# Altium schematic sheet alternative-amp.SchDoc
size A4
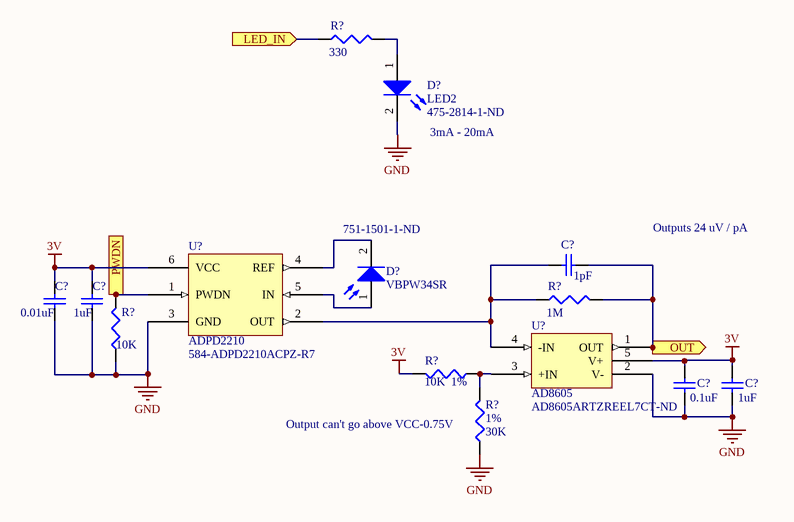
[diagram p0: alternative-amp.SchDoc]

## Parts
(Parts that share a designator on the sheet are numbered #1, #2 ... from top to bottom, then left to right.)
C?#1  value 1pF  [C1206]  (hidden comment: Cap Semi)
C?#2  value 0.01uF  [C1206]  (hidden comment: Cap Semi)
C?#3  value 1uF  [C1206]  (hidden comment: Cap Semi)
C?#4  value 0.1uF  [C1206]  (hidden comment: Cap Semi)
C?#5  value 1uF  [C1206]  (hidden comment: Cap Semi)
D?#1  LED2  Supplier Part Number: 475-2814-1-ND  [LB P4SG]
D?#2  VBPW34SR  Supplier Part Number: 751-1501-1-ND  [VBPW34SR]
R?#1  value 330  [J1-0603]  (hidden comment: Res3)
R?#2  value 1M  [J1-0603]  (hidden comment: Res3)
R?#3  value 10K  [J1-0603]  (hidden comment: Res3)
R?#4  1%  value 10K  [J1-0603]
R?#5  1%  value 30K  [J1-0603]
U?#1  ADPD2210  Supplier Part Number 1: 584-ADPD2210ACPZ-R7  [LFCSP_UD65P200X200-6N]
U?#2  AD8605  Supplier Part Number 1: AD8605ARTZREEL7CT-ND  [SOT23-6_N]

## Ports
LED_IN (in), OUT (out), PWDN

## Nets
3V: C?#2.2 C?#3.2 C?#4.2 C?#5.2 R?#4.2 U?#1.6(VCC) U?#2.5(V+)
GND: C?#2.1 C?#3.1 C?#4.1 C?#5.1 D?#1.2(K) R?#3.1 R?#5.1 U?#1.3(GND) U?#2.2(V-)
LED_IN: R?#1.1 ; port LED_IN
OUT: C?#1.2 R?#2.2 U?#2.1(OUT) ; port OUT
PWDN: R?#3.2 U?#1.1(PWDN) ; port PWDN
NetC?#1_1: C?#1.1 R?#2.1 U?#1.2(OUT) U?#2.4(-IN)
NetD?#1_1: D?#1.1(A) R?#1.2
NetD?#2_1: D?#2.1(A) U?#1.5(IN)
NetD?#2_2: D?#2.2(K) U?#1.4(REF)
NetR?#4_1: R?#4.1 R?#5.2 U?#2.3(+IN)

## Notes on the sheet
- (near D?#1) 3mA - 20mA
- Outputs 24 uV / pA
- (near R?#5) Output can't go above VCC-0.75V

## Library data of the parts
C?#1-C?#5 = Cap Semi: Capacitor (Semiconductor SIM Model); Published: 8-Jun-2000; LatestRevisionDate: 29-May-2009; LatestRevisionNote: IPC-7351 Footprint Added.; PackageReference: C1206; Publisher: Altium Limited; PackageDescription: Chip Capacitor
D?#1 = LED2: Typical RED, GREEN, YELLOW, AMBER GaAs LED; Published: 8-Jun-2000; LatestRevisionDate: 17-Jul-2002; LatestRevisionNote: Re-released for DXP Platform.; PackageVersion: Feb-2002; PackageReference: 3.2X1.6X1.1; Publisher: Altium Limited; PackageDescription: SM LED; 2 Flat Leads; Supplier: Digi-Key
D?#2 = Photo Sen: Photosensitive Diode; Published: 24-Mar-1999; LatestRevisionDate: 17-Jul-2002; LatestRevisionNote: Re-released for DXP Platform.; PackageReference: PIN2; Publisher: Altium Limited; Supplier: Digi-Key
R?#1-R?#5 = Res3: Resistor; Published: 8-Jun-2000; LatestRevisionDate: 29-May-2009; LatestRevisionNote: IPC-7351 Footprint Added.; PackageReference: J1-0603; Publisher: Altium Limited; PackageDescription: Chip Resistor
U?#1 = ADPD2210: Ultralow noise current amplifier for photodiodes.; Supplier 1: Mouser
U?#2 = AD8605: Low noise, precision rail-to-rail op-amp.; Supplier 1: Digi-Key